# Altium schematic sheet Outputs.SchDoc: Smart Bus Ticketing Machine/Outputs
size A4; Date: 3/10/2025; ApprovedBy: Kiran Gunathilaka; CheckedBy: Kiran Gunathilaka; Author: Kiran Gunathilaka; DrawnBy: Kiran Gunathilaka; Engineer: Kiran Gunathilaka; DocumentNumber: 08; Revision: v1.2; SheetNumber: 8; SheetTotal: 11
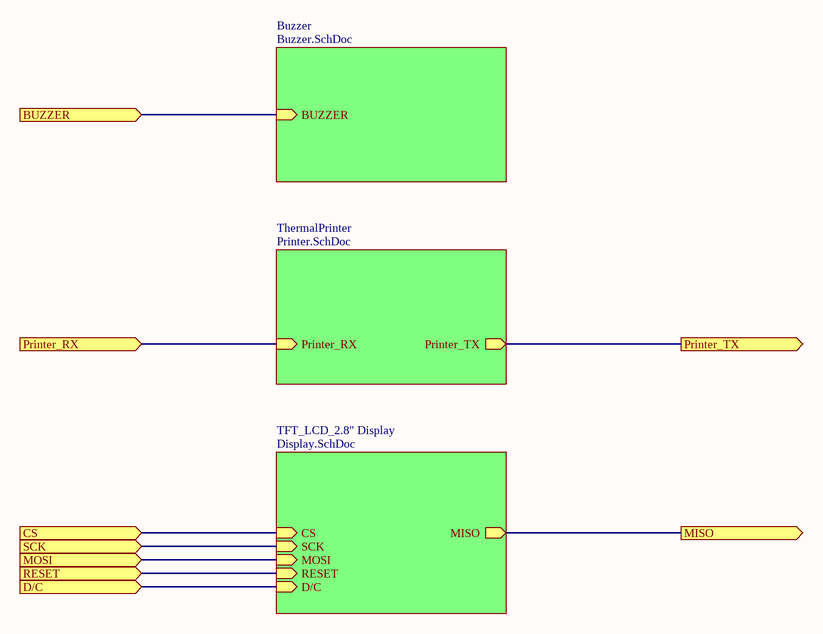
[diagram p0: Outputs.SchDoc]

## Sub-sheets
Buzzer = Buzzer.SchDoc: BUZZER (in)
TFT_LCD_2.8" Display = Display.SchDoc: CS (in), SCK (in), MOSI (in), RESET (in), D/C (in), MISO (out)
ThermalPrinter = Printer.SchDoc: Printer_TX (out), Printer_RX (in)

## Ports
BUZZER (in, see Main[3B], Buzzer[2B], MCU[4A]), CS (in, see Main[3C], Display[2C], MCU[4A]), D/C (in, see Main[3C], Display[2C], MCU[4A]), MISO (out, see Main[3B], Display[3B], MCU[1A]), MOSI (in, see Main[3C], Display[2C], MCU[4A]), Printer_RX (in, see Main[3B], Printer[2B]), Printer_TX (out, see Main[3B], Printer[3B]), RESET (in, see Main[3C], Display[2C], MCU[4A]), SCK (in, see Main[3B], Display[2C], MCU[4A])

## Nets
BUZZER: port BUZZER, sheet Buzzer/BUZZER
CS: port CS, sheet TFT_LCD_2.8" Display/CS
D/C: port D/C, sheet TFT_LCD_2.8" Display/D/C
MISO: port MISO, sheet TFT_LCD_2.8" Display/MISO
MOSI: port MOSI, sheet TFT_LCD_2.8" Display/MOSI
Printer_RX: port Printer_RX, sheet ThermalPrinter/Printer_RX
Printer_TX: port Printer_TX, sheet ThermalPrinter/Printer_TX
RESET: port RESET, sheet TFT_LCD_2.8" Display/RESET
SCK: port SCK, sheet TFT_LCD_2.8" Display/SCK